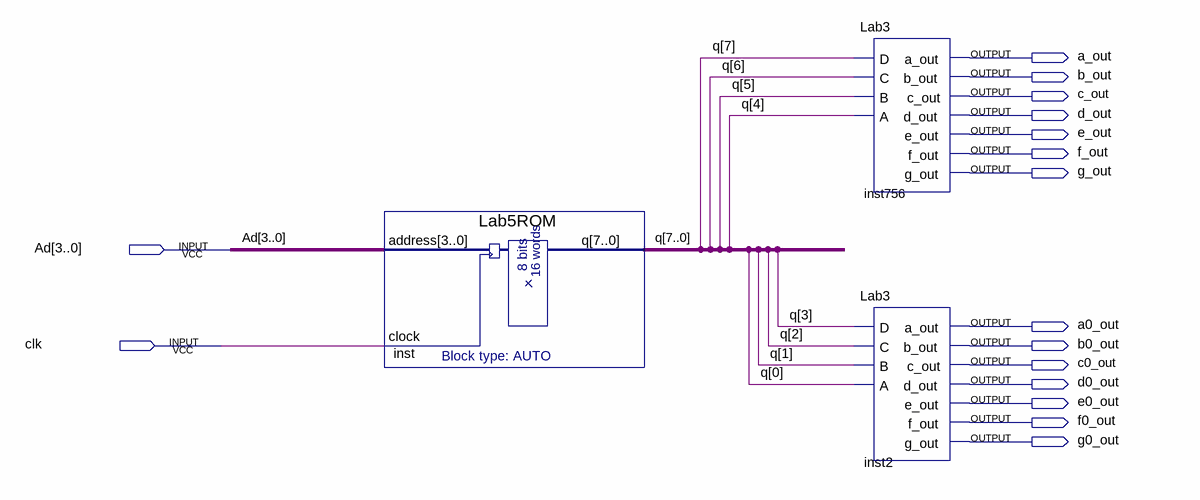
[diagram p0: schematic sheet]
// Quartus schematic Lab5.bdf as structural Verilog: 3 symbols, 16 pins
module Lab5 (
  input  [3:0] Ad,
  input  clk,
  output a_out,
  output b_out,
  output c_out,
  output d_out,
  output e_out,
  output f_out,
  output g_out,
  output a0_out,
  output b0_out,
  output c0_out,
  output d0_out,
  output e0_out,
  output f0_out,
  output g0_out
);

  wire [7:0] q;

  Lab5ROM inst (.address(Ad), .clock(clk), .q(q));
  Lab3 inst756 (
    .D(q[7]), .C(q[6]), .B(q[5]), .A(q[4]), .a_out(a_out), .b_out(b_out), .c_out(c_out), .d_out(d_out),
    .e_out(e_out), .f_out(f_out), .g_out(g_out));
  Lab3 inst2 (
    .D(q[3]), .C(q[2]), .B(q[1]), .A(q[0]), .a_out(a0_out), .b_out(b0_out), .c_out(c0_out), .d_out(d0_out),
    .e_out(e0_out), .f_out(f0_out), .g_out(g0_out));
endmodule
